# Altium schematic sheet MCU.SchDoc
size A3
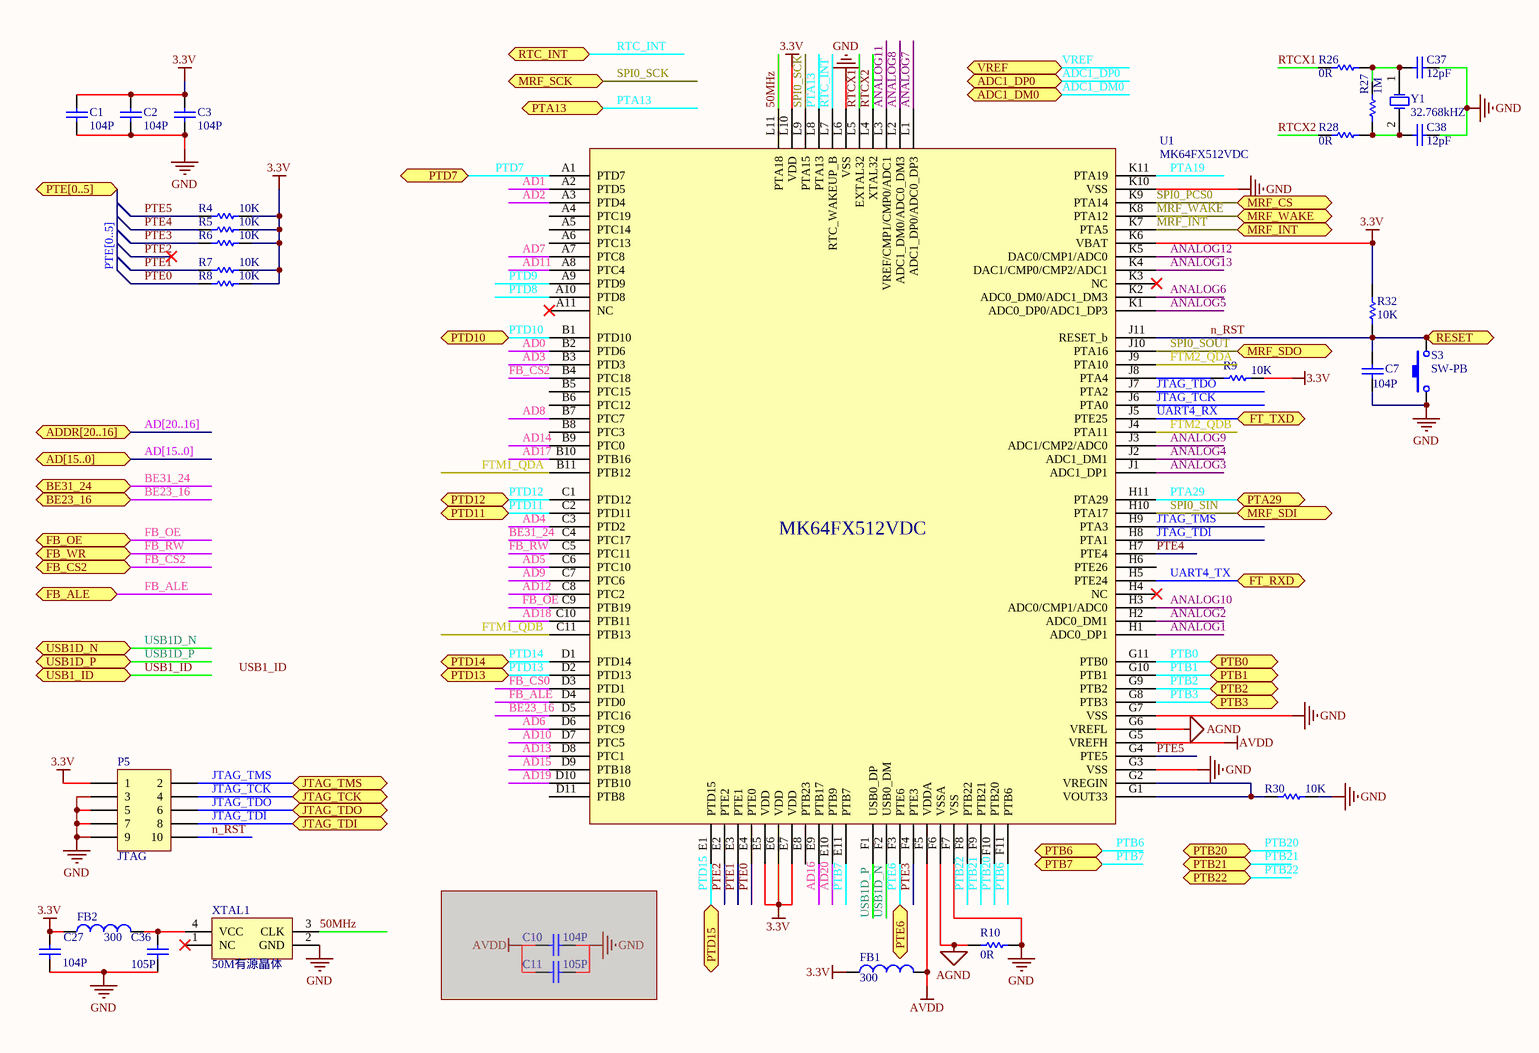
[diagram p0: MCU.SchDoc]

## Parts
C1  value 104P  [0402]  (hidden comment: Cap)
C2  value 104P  [0402]  (hidden comment: Cap)
C3  value 104P  [0402]  (hidden comment: Cap)
C7  value 104P  [1608[0603]]  (hidden comment: Cap)
C10  value 104P  [0402]  (hidden comment: Cap)  (masked out: inside a compile mask, not in the netlist)
C11  value 105P  [0402]  (hidden comment: Cap)  (masked out: inside a compile mask, not in the netlist)
C27  value 104P  [1608[0603]]  (hidden comment: Cap)
C36  value 105P  [1608[0603]]  (hidden comment: Cap)
C37  value 12pF  [1608[0603]]  (hidden comment: Cap)
C38  value 12pF  [1608[0603]]  (hidden comment: Cap)
FB1  value 300  [0402]  (hidden comment: Inductor)
FB2  value 300  [0402]  (hidden comment: Inductor)
P5  JTAG  [MHDR2X5]
R4  value 10K  [1608[0603]]  (hidden comment: Res)
R5  value 10K  [1608[0603]]  (hidden comment: Res)
R6  value 10K  [1608[0603]]  (hidden comment: Res)
R7  value 10K  [1608[0603]]  (hidden comment: Res)
R8  value 10K  [1608[0603]]  (hidden comment: Res)
R9  value 10K  [1608[0603]]  (hidden comment: Res)
R10  value 0R  [0402]  (hidden comment: Res)
R26  value 0R  [1608[0603]]  (hidden comment: Res)
R27  value 1M  [1608[0603]]  (hidden comment: Res)
R28  value 0R  [1608[0603]]  (hidden comment: Res)
R30  value 10K  [1608[0603]]  (hidden comment: Res)
R32  value 10K  [1608[0603]]  (hidden comment: Res)
S3  SW-PB  [key 3*4*2]
U1  MK64FX512VDC  [BGA121C65P11X11_800X800X50]
XTAL1  50M有源晶体  [XTAL7_3225]
Y1  32.768kHZ  [3215]

## Ports
AD[15..0], ADC1_DM0, ADC1_DP0, ADDR[20..16], BE23_16, BE31_24, FB_ALE, FB_CS2, FB_OE, FB_WR, FT_RXD, FT_TXD, JTAG_TCK, JTAG_TDI, JTAG_TDO, JTAG_TMS, MRF_CS, MRF_INT, MRF_SCK, MRF_SDI, MRF_SDO, MRF_WAKE, PTA13, PTA29, PTB0, PTB1, PTB2, PTB3, PTB6, PTB7, PTB20, PTB21, PTB22, PTD7, PTD10, PTD11, PTD12, PTD13, PTD14, PTD15, PTE6, PTE[0..5], RESET, RTC_INT, USB1_ID, USB1D_N, USB1D_P, VREF

## Nets
3.3V: C1.2 C2.2 C3.2 C27.2 FB1.1 FB2.1 P5.1 R4.1 R5.1 R6.1 R7.1 R8.1 R9.1 R32.1 U1.E5(VDD) U1.E6(VDD) U1.E7(VDD) U1.K6(VBAT) U1.L10(VDD)
AGND: R10.2 U1.F6(VSSA) U1.G6(VREFL)
AVDD: FB1.2 U1.F5(VDDA) U1.G5(VREFH)
GND: C1.1 C2.1 C3.1 C7.1 C27.1 C36.1 C37.1 C38.1 P5.3 P5.5 P5.7 P5.9 R10.1 R30.1 S3.1 U1.F7(VSS) U1.G3(VSS) U1.G7(VSS) U1.K10(VSS) U1.L6(VSS) XTAL1.2(GND)
50MHz: U1.L11(PTA18) XTAL1.3(CLK)
AD0: U1.B2(PTD6)
AD1: U1.A2(PTD5)
AD2: U1.A3(PTD4)
AD3: U1.B3(PTD3)
AD4: U1.C3(PTD2)
AD5: U1.C6(PTC10)
AD6: U1.D6(PTC9)
AD7: U1.A7(PTC8)
AD8: U1.B7(PTC7)
AD9: U1.C7(PTC6)
AD10: U1.D7(PTC5)
AD11: U1.A8(PTC4)
AD12: U1.C8(PTC2)
AD13: U1.D8(PTC1)
AD14: U1.B9(PTC0)
AD15: U1.D9(PTB18)
AD16: U1.E9(PTB17)
AD17: U1.B10(PTB16)
AD18: U1.C10(PTB11)
AD19: U1.D10(PTB10)
AD20: U1.E10(PTB9)
ADC1_DM0: port ADC1_DM0
ADC1_DP0: port ADC1_DP0
ANALOG1: U1.H1(ADC0_DP1)
ANALOG2: U1.H2(ADC0_DM1)
ANALOG3: U1.J1(ADC1_DP1)
ANALOG4: U1.J2(ADC1_DM1)
ANALOG5: U1.K1(ADC0_DP0/ADC1_DP3)
ANALOG6: U1.K2(ADC0_DM0/ADC1_DM3)
ANALOG7: U1.L1(ADC1_DP0/ADC0_DP3)
ANALOG8: U1.L2(ADC1_DM0/ADC0_DM3)
ANALOG9: U1.J3(ADC1/CMP2/ADC0)
ANALOG10: U1.H3(ADC0/CMP1/ADC0)
ANALOG11: U1.L3(VREF/CMP1/CMP0/ADC1)
ANALOG12: U1.K5(DAC0/CMP1/ADC0)
ANALOG13: U1.K4(DAC1/CMP0/CMP2/ADC1)
BE23_16: U1.D5(PTC16) ; port BE23_16
BE31_24: U1.C4(PTC17) ; port BE31_24
FB_ALE: U1.D4(PTD0) ; port FB_ALE
FB_CS0: U1.D3(PTD1)
FB_CS2: U1.B4(PTC18) ; port FB_CS2
FB_OE: U1.C9(PTB19) ; port FB_OE
FB_RW: U1.C5(PTC11) ; port FB_WR
FTM1_QDA: U1.B11(PTB12)
FTM1_QDB: U1.C11(PTB13)
FTM2_QDA: U1.J9(PTA10)
FTM2_QDB: U1.J4(PTA11)
JTAG_TCK: P5.4 U1.J6(PTA0) ; port JTAG_TCK
JTAG_TDI: P5.8 U1.H8(PTA1) ; port JTAG_TDI
JTAG_TDO: P5.6 U1.J7(PTA2) ; port JTAG_TDO
JTAG_TMS: P5.2 U1.H9(PTA3) ; port JTAG_TMS
MRF_INT: U1.K7(PTA5) ; port MRF_INT
MRF_WAKE: U1.K8(PTA12) ; port MRF_WAKE
n_RST: C7.2 P5.10 R32.2 S3.2 U1.J11(RESET_b) ; port RESET
PTA13: U1.L8(PTA13) ; port PTA13
PTA19: U1.K11(PTA19)
PTA29: U1.H11(PTA29) ; port PTA29
PTB0: U1.G11(PTB0) ; port PTB0
PTB1: U1.G10(PTB1) ; port PTB1
PTB2: U1.G9(PTB2) ; port PTB2
PTB3: U1.G8(PTB3) ; port PTB3
PTB6: U1.F11(PTB6) ; port PTB6
PTB7: U1.E11(PTB7) ; port PTB7
PTB20: U1.F10(PTB20) ; port PTB20
PTB21: U1.F9(PTB21) ; port PTB21
PTB22: U1.F8(PTB22) ; port PTB22
PTD7: U1.A1(PTD7) ; port PTD7
PTD8: U1.A10(PTD8)
PTD9: U1.A9(PTD9)
PTD10: U1.B1(PTD10) ; port PTD10
PTD11: U1.C2(PTD11) ; port PTD11
PTD12: U1.C1(PTD12) ; port PTD12
PTD13: U1.D2(PTD13) ; port PTD13
PTD14: U1.D1(PTD14) ; port PTD14
PTD15: U1.E1(PTD15) ; port PTD15
PTE0: R8.2 U1.E4(PTE0)
PTE1: R7.2 U1.E3(PTE1)
PTE2: U1.E2(PTE2)
PTE3: R6.2 U1.F4(PTE3)
PTE4: R5.2 U1.H7(PTE4)
PTE5: R4.2 U1.G4(PTE5)
PTE6: U1.F3(PTE6) ; port PTE6
RTC_INT: U1.L7(RTC_WAKEUP_B) ; port RTC_INT
RTCX1: R26.2 U1.L5(EXTAL32)
RTCX2: R28.2 U1.L4(XTAL32)
SPI0_PCS0: U1.K9(PTA14) ; port MRF_CS
SPI0_SCK: U1.L9(PTA15) ; port MRF_SCK
SPI0_SIN: U1.H10(PTA17) ; port MRF_SDI
SPI0_SOUT: U1.J10(PTA16) ; port MRF_SDO
UART4_RX: U1.J5(PTE25) ; port FT_TXD
UART4_TX: U1.H5(PTE24) ; port FT_RXD
USB1_ID: port USB1_ID
USB1D_N: U1.F2(USB0_DM) ; port USB1D_N
USB1D_P: U1.F1(USB0_DP) ; port USB1D_P
VREF: port VREF
NetC36_2: C36.2 FB2.2 XTAL1.4(VCC)
NetC37_2: C37.2 R26.1 R27.1 Y1.1(OSC1)
NetC38_2: C38.2 R27.2 R28.1 Y1.2(OSC2)
NetR9_2: R9.2 U1.J8(PTA4)
NetR30_2: R30.2 U1.G1(VOUT33) U1.G2(VREGIN)

Not connected (* = marked no-connect by the designer): U1 A4(PTC19) A5(PTC14) A6(PTC13) A11(NC)* B5(PTC15) B6(PTC12) B8(PTC3) D11(PTB8) E8(PTB23) H4(NC)* H6(PTE26) K3(NC)*; XTAL1 1(NC)*

## Buses and harness runs
bus AD[15..0] = port AD[15..0]
bus AD[20..16] = port ADDR[20..16]
bus PTE[0..5] = port PTE[0..5]

## Notes on the sheet
- Labels drawn without touching a wire or pin: USB1_ID

## Library data of the parts
C1-C3 C7 C10 C11 C27 C36-C38 = Cap: 贴片电容; Published: 8-Jun-2000; LatestRevisionDate: 17-Jul-2002; LatestRevisionNote: Re-released for DXP Platform.; PackageReference: RAD-0.3; Publisher: Altium Limited
FB1 FB2 = Inductor: Code_IEC: 1005; Published: 8-Jun-2000; LatestRevisionDate: 29-May-2009; LatestRevisionNote: IPC-7351 Footprint Added.; PackageReference: 0402-A; Publisher: Altium Limited; PackageDescription: Chip Inductor; Code_JEITA: 0402
P5 = Header 5X2: Header, 5-Pin, Dual row; LatestRevisionDate: 17-Jul-2002; LatestRevisionNote: Re-released for DXP Platform.; Publisher: Altium Limited
R4-R10 R26-R28 R30 R32 = Res: 贴片电阻; Published: 8-Jun-2000; LatestRevisionDate: 17-Jul-2002; LatestRevisionNote: Re-released for DXP Platform.; PackageReference: AXIAL-0.3; Publisher: Altium Limited
S3 = SW-PB: Switch
XTAL1 = 有源晶体
Y1 = XTAL: 晶体振荡器; Published: 8-Jun-2000; LatestRevisionDate: 17-Jul-2002; LatestRevisionNote: Re-released for DXP Platform.; PackageReference: R38; Publisher: Altium Limited